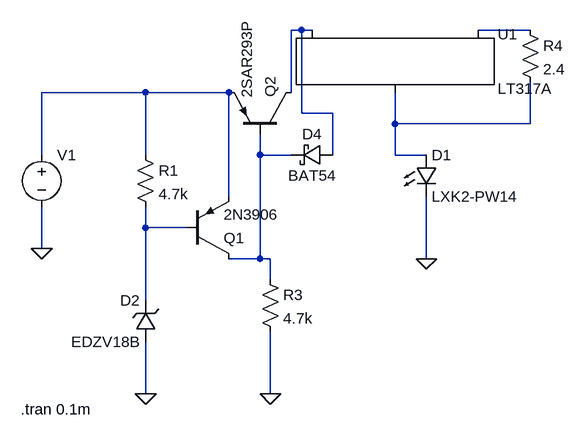
[diagram p0: schematic simulation 2.asc]
simulation 2.asc, the LTspice schematic file:
Version 4
SHEET 1 968 680
WIRE 416 -96 400 -96
WIRE 432 -96 416 -96
WIRE 768 -96 688 -96
WIRE 176 0 16 0
WIRE 304 0 176 0
WIRE 400 0 400 -96
WIRE 416 32 416 -96
WIRE 464 32 416 32
WIRE 560 48 560 0
WIRE 768 48 768 -16
WIRE 768 48 560 48
WIRE 16 96 16 0
WIRE 176 96 176 0
WIRE 352 96 352 64
WIRE 400 96 352 96
WIRE 464 96 464 32
WIRE 560 96 560 48
WIRE 608 96 560 96
WIRE 304 160 304 0
WIRE 176 208 176 176
WIRE 240 208 176 208
WIRE 16 240 16 176
WIRE 352 256 352 96
WIRE 352 256 304 256
WIRE 368 256 352 256
WIRE 608 256 608 160
WIRE 368 288 368 256
WIRE 176 320 176 208
WIRE 176 464 176 384
WIRE 368 464 368 368
FLAG 16 240 0
FLAG 608 256 0
FLAG 368 464 0
FLAG 176 464 0
SYMBOL voltage 16 80 R0
WINDOW 123 0 0 Left 0
WINDOW 39 0 0 Left 0
WINDOW 3 24 44 Left 2
SYMATTR InstName V1
SYMATTR Value ""
SYMBOL res 160 80 R0
SYMATTR InstName R1
SYMATTR Value 4.7k
SYMBOL LED 592 96 R0
SYMATTR InstName D1
SYMATTR Value LXK2-PW14
SYMBOL res 752 -112 R0
SYMATTR InstName R4
SYMATTR Value 2.4
SYMBOL zener 192 384 R180
WINDOW 0 24 64 Left 2
WINDOW 3 24 0 Left 2
SYMATTR InstName D2
SYMATTR Value EDZV18B
SYMBOL PowerProducts\\LT317A 560 -96 R0
SYMATTR InstName U1
SYMBOL pnp 240 256 M180
SYMATTR InstName Q1
SYMATTR Value 2N3906
SYMBOL pnp 400 64 M270
SYMATTR InstName Q2
SYMATTR Value 2SAR293P
SYMBOL res 352 272 R0
SYMATTR InstName R3
SYMATTR Value 4.7k
SYMBOL schottky 464 80 R90
WINDOW 0 0 32 VBottom 2
WINDOW 3 32 32 VTop 2
SYMATTR InstName D4
SYMATTR Value BAT54
TEXT -16 488 Left 2 !.tran 0.1m

The netlist it stands for:
* simulation 2.asc
V1 N003 0
R1 N003 N006 4.7k
D1 N004 0 LXK2-PW14
R4 N002 N004 2.4
D2 0 N006 EDZV18B
XU1 N004 N002 N001 LT317A
Q1 N005 N006 N003 0 2N3906
Q2 N001 N005 N003 0 2SAR293P
R3 N005 0 4.7k
D4 N001 N005 BAT54
.model D D
.lib standard.dio
.model NPN NPN
.model PNP PNP
.lib standard.bjt
.tran 0.1m
.lib LTC.lib
.backanno
.end